# Altium schematic sheet Power.SchDoc
size 292 x 193 mm; Author: Power Lin; DocumentNumber: 4; SheetNumber: 4; SheetTotal: 4; Website: wiki-power.com
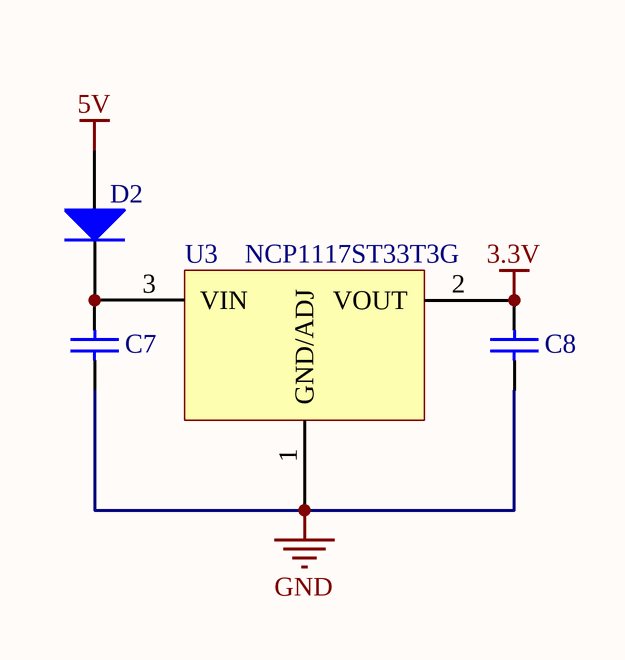
[diagram p0: Power.SchDoc]

## Parts
C7  10uF  [CAP-0603]  (value not drawn)
C8  10uF  [CAP-0603]  (value not drawn)
D2  SS14 6V  [SOD_123]  (value not drawn)
U3  NCP1117ST33T3G  [SOT-223]

## Nets
3.3V: C8.2 U3.2(VOUT)
5V: D2.1(A)
GND: C7.1 C8.1 U3.1(GND/ADJ)
NetC7_2: C7.2 D2.2(K) U3.3(VIN)

## Notes on the sheet
- Author
- DocumentName
- ModifiedDate
- ProjectName
- SheetNumber
- SheetTotal
- Website
- Revision

## Library data of the parts
C7 C8 = CAP: 贴片电容; ComponentLink1Description: 供应商链接; ComponentLink1URL: http://www.szlcsc.com/product/details_53938.html; Package: 0402; Supplier: LC; SuppliersPartNumber: C52923
D2 = DIODE: 二极管; ComponentLink1Description: 供应商链接; ComponentLink1URL: http://www.szlcsc.com/product/details_23178.html; Package: SMA(DO-214AC); Supplier: LC; SuppliersPartNumber: C22452
U3 = NCP1117: NCP1117, NCV1117. 1.0 A Low-Dropout Positive  Fixed and Adjustable  Voltage Regulators